# EAGLE design ESP (EAGLE 7.3.0)
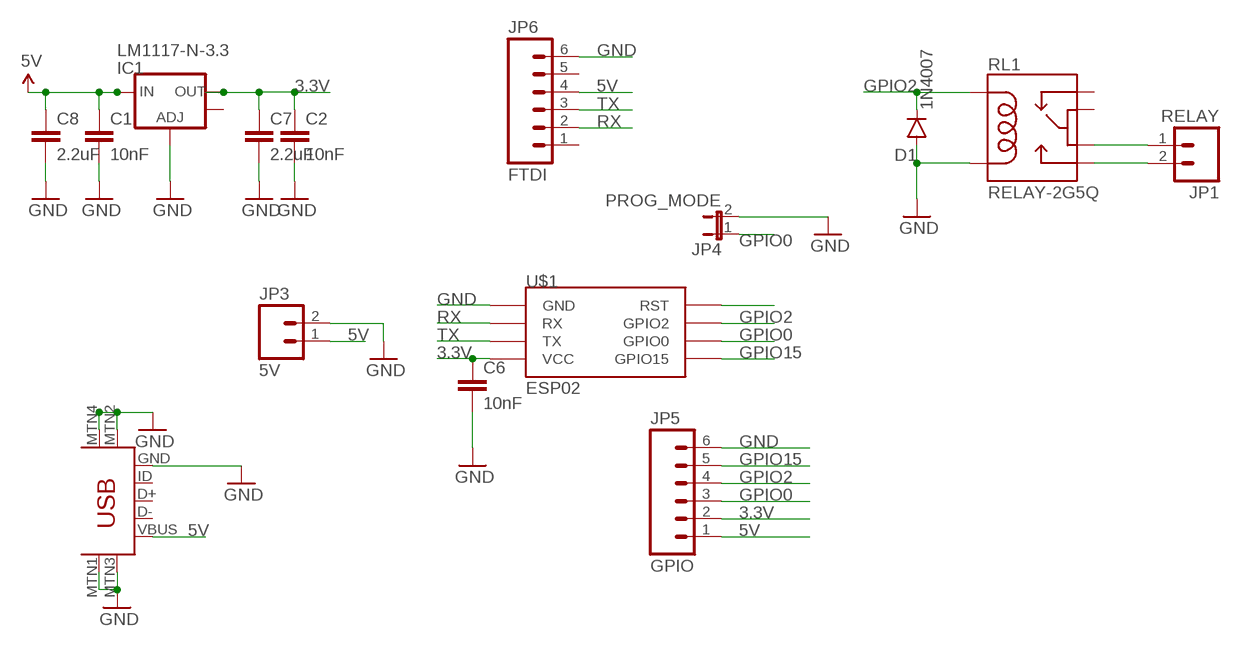
[diagram p0: schematic, sheet 1]

## Parts
C1  10nF  10NF/10000PF-50V-10%(0603)  [0603-CAP]
C2  10nF  10NF/10000PF-50V-10%(0603)  [0603-CAP]
C6  10nF  10NF/10000PF-50V-10%(0603)  [0603-CAP]
C7  2.2uF  2.2UF-25V-+80/-20(0805)  [0805]
C8  2.2uF  2.2UF-25V-+80/-20(0805)  [0805]
D1  1N4007  DIODESMB  [SMB-DIODE]
IC1  LM1117-N-3.3  V_REG_LM1117SOT223  [SOT223]
JP1  RELAY  M025MM  [SCREWTERMINAL-5MM-2]
JP3  5V  M025MM  [SCREWTERMINAL-5MM-2]
JP4  PROG_MODE  JUMPER-2PTH  [1X02]
JP5  GPIO  M06SILK_FEMALE_PTH  [1X06]
JP6  FTDI  M06SILK_FEMALE_PTH  [1X06]
RL1  RELAY-2G5Q  [RELAY-G5V]
U$1  ESP02  [ESP02]
U$2  USB  USB-MINIB-5PIN  [USB-MINIB]

## Nets
3.3V: C2.1 C6.1 C7.1 IC1.2(OUT) JP5.2 U$1.VCC
5V: C1.1 C8.1 IC1.3(IN) JP3.1 JP5.1 JP6.4 U$2.VBUS
GND: C1.2 C2.2 C6.2 C7.2 C8.2 D1.A IC1.1(ADJ) JP3.2 JP4.2 JP5.6 JP6.6 RL1.9 U$1.GND U$2.GND U$2.MTN1(MTN2) U$2.MTN2(MTN3) U$2.MTN3(MTN1) U$2.MTN4
GPIO0: JP4.1 JP5.3 U$1.GPIO0
GPIO2: D1.C JP5.4 RL1.2 U$1.GPIO2
GPIO15: JP5.5 U$1.GPIO15/POWERDOWN(GPIO15)
N$2: JP1.2 RL1.10
N$3: JP1.1 RL1.6
N$5: U$1.RST
RX: JP6.2 U$1.RX
TX: JP6.3 U$1.TX
Unconnected: IC1.4(OUT) JP6.1 JP6.5 RL1.1 RL1.5 U$2.D+ U$2.D- U$2.ID

## Library data of the parts
C1 C2 C6 = SparkFun-Capacitors:10NF/10000PF-50V-10%(0603): CAP-00867; PROD_ID: CAP-00867
C7 C8 = SparkFun-Capacitors:2.2UF-25V-+80/-20(0805): CAP-11624; PROD_ID: CAP-11624
D1 = SparkFun-DiscreteSemi:DIODE: Diode These are standard reverse protection diodes and small signal diodes. SMA package can handle up to about 1A. SOD-323 can handle about 200mA. What the SOD-323 package when ordering, there are some mfgs out there that are 5-pin packages.; PROD_ID: DIO-09646
IC1 = SparkFun-PowerIC:V_REG_LM1117: Voltage Regulator LM1117 Standard adjustable voltage regulator but in SMD form. Spark Fun Electronics SKU : COM-00595; PROD_ID: VREG-08170
JP1 JP3 = SparkFun-Connectors:M02: Standard 2-pin 0.1" header. Use with - straight break away headers ( PRT-00116) - right angle break away headers (PRT-00553) - swiss pins (PRT-00743) - machine pins (PRT-00117) - female headers (PRT-00115) Molex polarized connector foot print use with: PRT-08233 with associated crimp pins and housings. 2.54_SCREWTERM for use with PRT-10571. 3.5mm Screw Terminal footprints for PRT-08084 5mm Screw Terminal footprints for use with PRT-08432; STOREFRONT_ID: PRT-08432
JP4 = SparkFun-Retired:JUMPER-2: Jumper Basic 0.1" spaced jumper. Use with breakaway headers.
JP5 JP6 = SparkFun-Connectors:M06: Header 6 Standard 6-pin 0.1" header. Use with straight break away headers (SKU : PRT-00116), right angle break away headers (PRT-00553), swiss pins (PRT-00743), machine pins (PRT-00117), and female headers (PRT-00115). Molex polarized connector foot print use with SKU : PRT-08094 with associated crimp pins and housings. NOTES ON THE VARIANTS LOCK and LOCK_LONGPADS... This footprint was designed to help hold the alignment of a through-hole component (i.e. 6-pin header) while soldering it into place. You may notice that each hole has been shifted either up or down by 0.005 of an inch from it's more standard position (which is a perfectly straight line). This slight alteration caused the pins (the squares in the middle) to touch the edges of the holes. Because they are alternating, it causes a "brace" to hold the component in place. 0.005 has proven to be the perfect amount of "off-center" position when using our standard breakaway headers. Although looks a little odd when you look at the bare footprint, once you have a header in there, the alteration is very hard to notice. Also,if you push a header all the way into place, it is covered up entirely on the bottom side. This idea of altering the position of holes to aid alignment will be further integrated into the Sparkfun Library for other footprints. It can help hold any component with 3 or more connection pins.; PROD_ID: CONN-08437
RL1 = SparkFun-Electromechanical:RELAY-2: SPDT relay (COM-00100)
U$1 = esp8266modules:ESP02: ESP8266 Wifi module 02
U$2 = SparkFun-Connectors:USB-MINIB: Mini-USB "B" connector with 5th pin broken out. Created new symbol breaking out 5th "ID" pin in mini/micro USB connector spec. See: http://en.wikipedia.org/wiki/Mini_usb#Cables. Uses same footprint as 4-pin symbol. Also added pins to connect to mounting / shield pads if required (probably not generally needed as signals aren't shielded once they leave the connector).

## Board
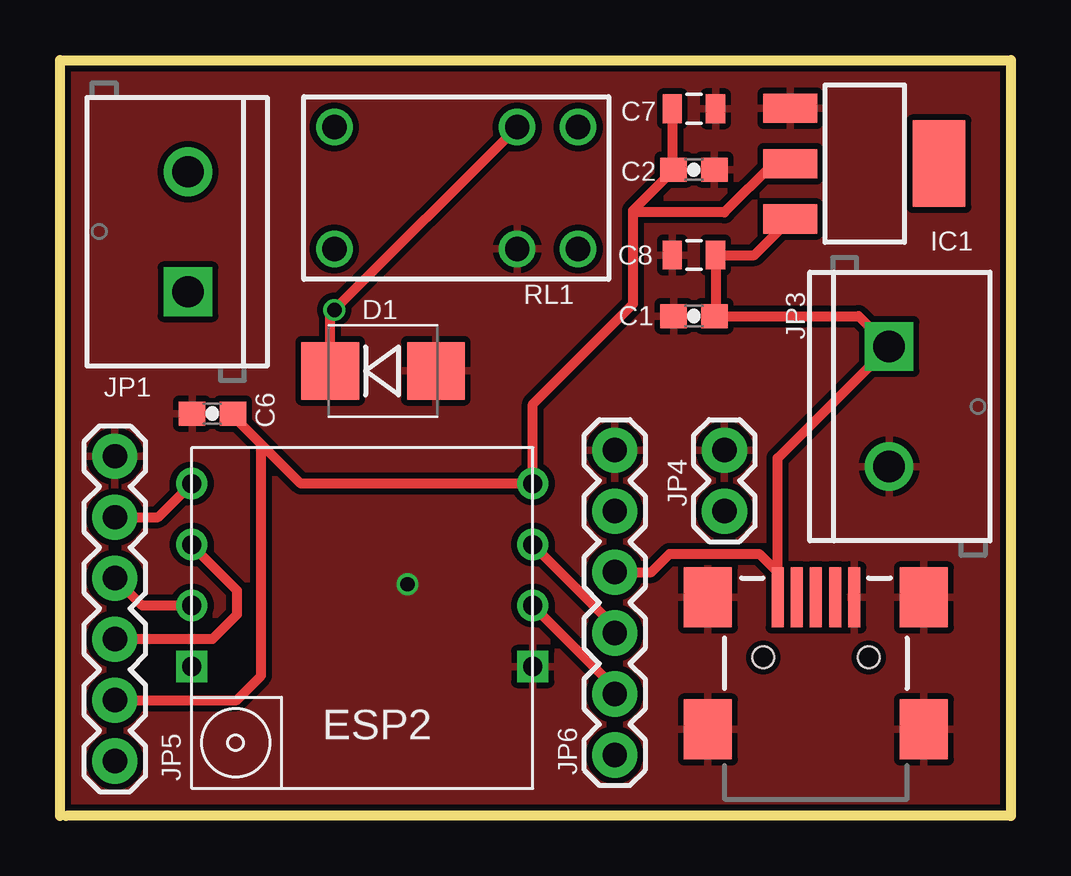
[diagram p1: board, top side]
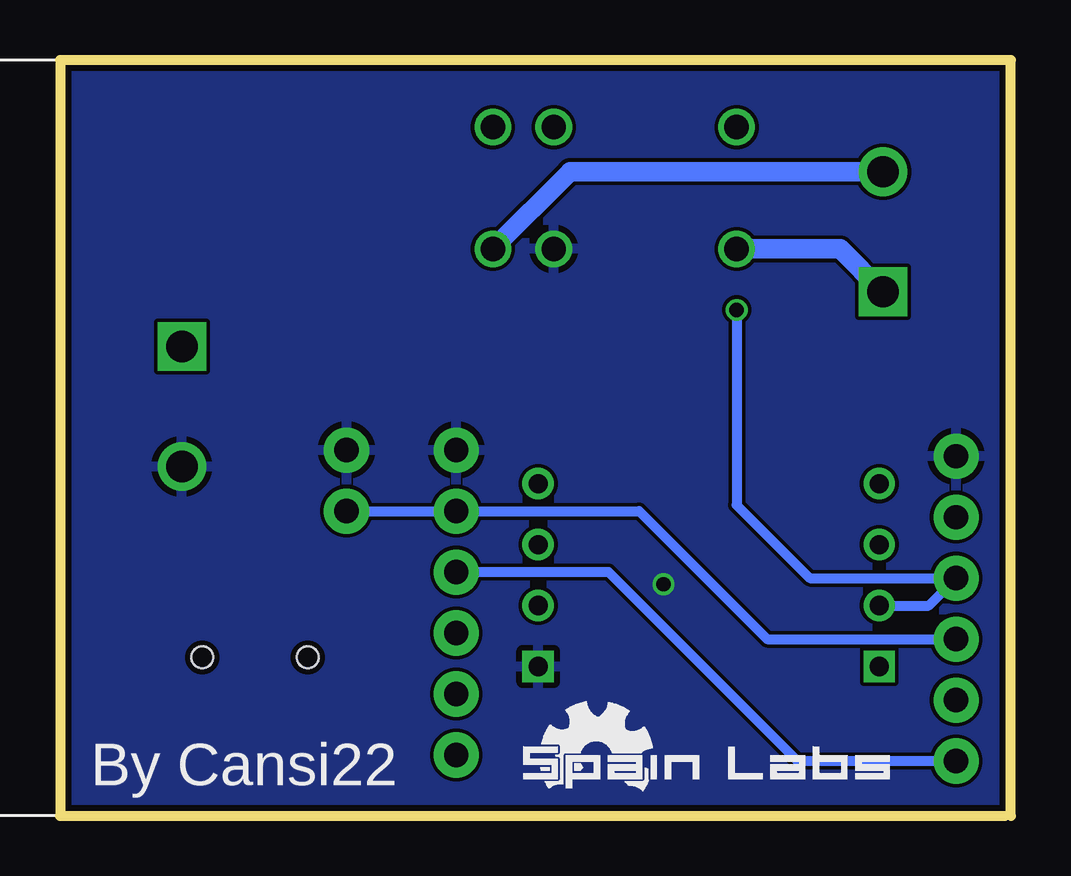
[diagram p2: board, bottom side, seen from below]

Size 39.62 x 31.5 mm. Coordinates in mm from the lower left corner, seen from the top.
Outline: 39.6,0 39.6,31.42 0,31.5
Outline: 0,31.5 0,31.5
Outline: 0,31.5 0,0 0.25,0 39.6,0
Outline: 0,31.5 39.62,31.5 39.62,0 39.6,0
Copper layers (1*16): Top 0.035mm / dielectric 1.5mm / Bottom 0.035mm
Design rules "Elecrow_2-layer_eagle_rule": minimum track width 6mil, minimum drill 12mil, track to track 6mil, track to pad 6mil, pad to pad 6mil, via to via 6mil, smd to smd 0mil, copper to edge 10mil, drill to drill 10mil, minimum pad ring 10mil, minimum via ring 6mil, stop-mask expansion 2mil, vias tented up to drill 100mil, thermal gap 10mil

### Footprints (pad centres in the part's own frame; a part is rotated, then mirrored left to right if it is on the bottom)
0603-CAP = smd 1.1 x 1: 1 -0.85,0; 2 0.85,0
0805 = smd 0.8 x 1.2: 1 -0.9,0; 2 0.9,0
SMB-DIODE = smd 2.4 x 2.4: A 2.2,0; C -2.2,0
SOT223 = smd 1.219 x 2.235: 1 -2.311,-3.099; 2 0,-3.099; 3 2.311,-3.099 | smd 3.6 x 2.2: 4 0,3.099
SCREWTERMINAL-5MM-2 = drill 1.3 pad 2.032 square: 1 0,0 | drill 1.3 pad 2.032: 2 5,0
1X02 = drill 1.016 pad 1.88: 1 0,0; 2 2.54,0
1X06 = drill 1.016 pad 1.88: 1 0,0; 2 2.54,0; 3 5.08,0; 4 7.62,0; 5 10.16,0; 6 12.7,0
RELAY-G5V = drill 1.016: 1 5.08,2.54; 2 2.54,2.54; 5 -5.08,2.54; 6 -5.08,-2.54; 9 2.54,-2.54; 10 5.08,-2.54
ESP02 = drill 0.8 square: GND -7,2.92; RST 7.21,2.92 | drill 0.8: GPIO0 7.21,-2.16; GPIO2 7.21,0.38; GPIO15/POWERDOWN 7.21,-4.7; RX -7,0.38; TX -7,-2.16; VCC -7,-4.7
USB-MINIB = smd 2.5 x 0.5: D+ 2.5,0; D- 2.5,0.8; GND 2.5,-1.6; ID 2.5,-0.8; VBUS 2.5,1.6 | smd 2.5 x 2: MTN1 -3,4.5; MTN2 2.5,4.5; MTN3 -3,-4.5; MTN4 2.5,-4.5 | hole 0.9: 0,2.2; 0,-2.2

### Placement (x,y rotation side)
C1  26.42,20.83 180 top
C2  26.42,26.92 0 top
C6  6.35,16.76 180 top
C7  26.42,29.46 0 top
C8  26.42,23.37 180 top
D1  13.46,18.54 0 top
IC1  33.53,27.18 270 top
JP1  5.33,21.84 90 top
JP3  34.54,19.56 270 top
JP4  27.69,12.7 90 top
JP5  2.29,2.29 90 top
JP6  23.11,2.54 90 top
RL1  16.51,26.16 0 top
U$1  12.7,9.14 180 top
U$2  31.5,6.6 90 top
U$3  [SL]  20.57,0.76 0 bottom

### Tracks (layer width: path | path; a pad name or v marks a point on that pad's centre or on a via)
3.3V
  Top 0.406: C7.1 25.52,26.97 C2.1 23.88,25.23 23.88,25.15 | JP5.2 7.37,4.83 8.38,5.84 8.38,15.49 | 8.38,15.49 7.2,16.68 C6.1 | 8.38,15.49 10.03,13.84 U$1.VCC 19.7,17.16 23.88,21.34 23.88,25.15 | IC1.2 29.72,27.18 27.69,25.15 23.88,25.15
5V
  Top 0.406: U$2.VBUS 29.9,10.16 | 29.9,10.16 29.9,14.91 JP3.1 33.27,20.83 C1.1 27.32,20.88 C8.1 28.93,23.37 IC1.3 | JP6.4 24.64,10.16 25.4,10.92 29.13,10.92 29.9,10.16
  Bottom 0.406: JP5.1 8.89,2.29 16.76,10.16 JP6.4
GND  (via drill 0.6)
  other vias: 14.48,9.65
  pour Top (isolate 0.254): 0,31.5 39.62,31.5 39.62,0 0,0
  pour Bottom (isolate 0.003): 0,0 39.62,0 39.62,31.5 0,31.5
GPIO0
  Top 0.406: U$1.GPIO0 5.49,11.27 7.37,9.4 7.37,8.38 6.35,7.37 JP5.3
  Bottom 0.406: JP4.1 15.49,12.7 10.16,7.37 JP5.3
GPIO2  (via drill 0.6)
  Top 0.406: RL1.2 v11.43,21.08 11.26,20.91 D1.C | U$1.GPIO2 3.43,8.76 JP5.4
  Bottom 0.406: U$1.GPIO2 3.43,8.76 JP5.4 8.38,9.91 11.43,12.95 v11.43,21.08
GPIO15
  Top 0.406: JP5.5 4.09,12.45 U$1.GPIO15/POWERDOWN
N$2
  Bottom 0.813: JP1.2 18.37,26.84 RL1.10
N$3
  Bottom 0.813: RL1.6 7.11,23.62 JP1.1
RX
  Top 0.406: U$1.RX 23.11,5.35 JP6.2
TX
  Top 0.406: U$1.TX 23.11,7.89 JP6.3

### Text on the board
bNames: By Cansi22